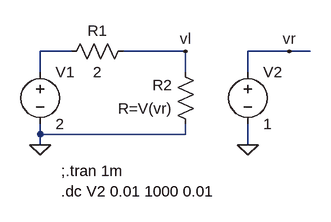
[diagram p0: schematic 05-maximum_power_transfer.asc]
05-maximum_power_transfer.asc, the LTspice schematic file:
Version 4
SHEET 1 880 680
WIRE 96 112 48 112
WIRE 272 112 176 112
WIRE 432 112 368 112
WIRE 464 112 432 112
WIRE 48 144 48 112
WIRE 272 144 272 112
WIRE 368 144 368 112
WIRE 48 240 48 224
WIRE 272 240 272 224
WIRE 272 240 48 240
WIRE 48 256 48 240
WIRE 368 256 368 224
FLAG 48 256 0
FLAG 368 256 0
FLAG 432 112 vr
FLAG 272 112 vl
SYMBOL res 192 96 R90
WINDOW 0 0 56 VBottom 2
WINDOW 3 32 56 VTop 2
SYMATTR InstName R1
SYMATTR Value 2
SYMBOL res 288 240 R180
WINDOW 0 36 76 Left 2
WINDOW 3 36 40 Left 2
SYMATTR InstName R2
SYMATTR Value R=V(vr)
SYMBOL voltage 48 128 R0
WINDOW 123 0 0 Left 0
WINDOW 39 0 0 Left 0
SYMATTR InstName V1
SYMATTR Value 2
SYMBOL voltage 368 128 R0
WINDOW 123 0 0 Left 0
WINDOW 39 0 0 Left 0
SYMATTR InstName V2
SYMATTR Value 1
TEXT 80 296 Left 2 !;.tran 1m
TEXT 80 328 Left 2 !.dc V2 0.01 1000 0.01

The netlist it stands for:
* 05-maximum_power_transfer.asc
R1 vl N001 2
R2 0 vl R=V(vr)
V1 N001 0 2
V2 vr 0 1
;.tran 1m
.dc V2 0.01 1000 0.01
.backanno
.end

* Results of the author's LTspice run, read from the files saved beside the schematic
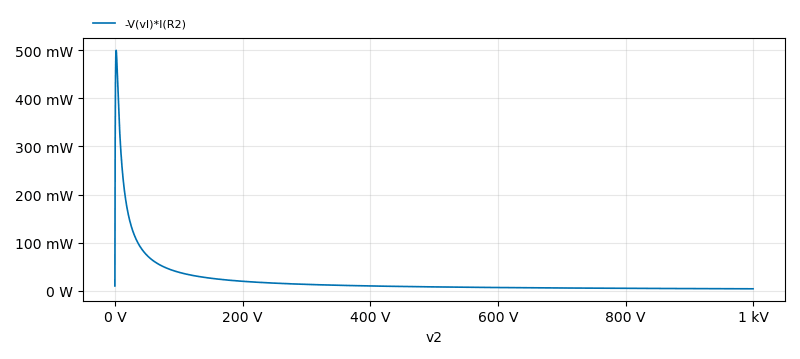
[diagram p1: DC transfer characteristic of 05-maximum_power_transfer.asc, plotted from the saved traces]
* DC transfer characteristic, 1 run:
*   -V(vl)*I(R2): 9.901 mW at v2=10 mV, 3.984 mW at v2=1 kV, min 3.984 mW, max 500 mW